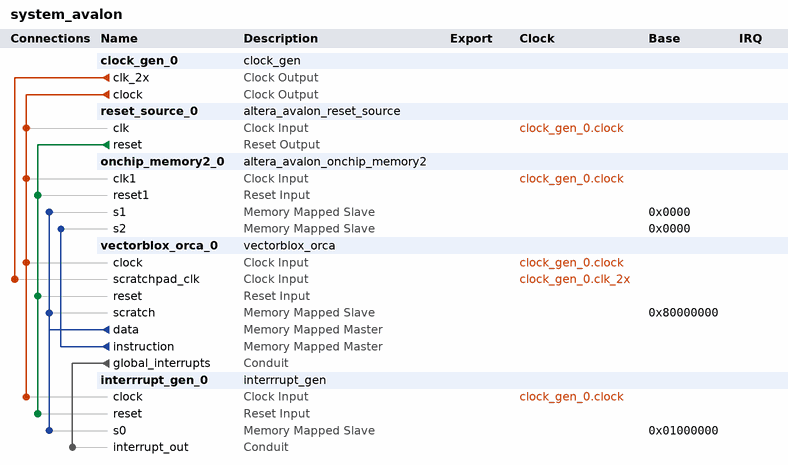
[diagram p0: system contents]
# Platform Designer (Qsys) system system_avalon, Cyclone IV E Unknown
# Parameters at their usual value, and those the tool derives, are not listed.
package require -exact qsys 15.1
create_system system_avalon
set_project_property DEVICE_FAMILY {Cyclone IV E}
set_project_property DEVICE Unknown

add_instance clock_gen_0 clock_gen 1.0
set_instance_parameter_value clock_gen_0 CLK_MHZ 1000

add_instance reset_source_0 altera_avalon_reset_source 15.1
set_instance_parameter_value reset_source_0 ASSERT_HIGH_RESET 1
set_instance_parameter_value reset_source_0 INITIAL_RESET_CYCLES 6

add_instance onchip_memory2_0 altera_avalon_onchip_memory2 15.1
set_instance_parameter_value onchip_memory2_0 dataWidth 32
set_instance_parameter_value onchip_memory2_0 dualPort true
set_instance_parameter_value onchip_memory2_0 initMemContent true
set_instance_parameter_value onchip_memory2_0 initializationFileName test.hex
set_instance_parameter_value onchip_memory2_0 memorySize 65536
set_instance_parameter_value onchip_memory2_0 singleClockOperation true
set_instance_parameter_value onchip_memory2_0 useNonDefaultInitFile true

add_instance vectorblox_orca_0 vectorblox_orca 1.0
set_instance_parameter_value vectorblox_orca_0 BRANCH_PREDICTION false
set_instance_parameter_value vectorblox_orca_0 BTB_SIZE 0
set_instance_parameter_value vectorblox_orca_0 BURST_EN 0
set_instance_parameter_value vectorblox_orca_0 BUS_TYPE Avalon
set_instance_parameter_value vectorblox_orca_0 BYTE_SIZE 8
set_instance_parameter_value vectorblox_orca_0 CACHE_ENABLE 0
set_instance_parameter_value vectorblox_orca_0 CACHE_SIZE 64
set_instance_parameter_value vectorblox_orca_0 COUNTER_LENGTH 64
set_instance_parameter_value vectorblox_orca_0 DIVIDE_ENABLE 1
set_instance_parameter_value vectorblox_orca_0 DRAM_WIDTH 32
set_instance_parameter_value vectorblox_orca_0 ENABLE_EXCEPTIONS 1
set_instance_parameter_value vectorblox_orca_0 ENABLE_EXT_INTERRUPTS 1
set_instance_parameter_value vectorblox_orca_0 EXT_INTERRUPTS 1
set_instance_parameter_value vectorblox_orca_0 FAMILY ALTERA
set_instance_parameter_value vectorblox_orca_0 INTERRUPT_VECTOR 512
set_instance_parameter_value vectorblox_orca_0 LINE_SIZE 16
set_instance_parameter_value vectorblox_orca_0 LVE_ENABLE 1
set_instance_parameter_value vectorblox_orca_0 MULTIPLY_ENABLE 1
set_instance_parameter_value vectorblox_orca_0 PIPELINE_STAGES 5
set_instance_parameter_value vectorblox_orca_0 POWER_OPTIMIZED 0
set_instance_parameter_value vectorblox_orca_0 REGISTER_SIZE 32
set_instance_parameter_value vectorblox_orca_0 RESET_VECTOR 0
set_instance_parameter_value vectorblox_orca_0 SCRATCHPAD_SIZE 64
set_instance_parameter_value vectorblox_orca_0 SHIFTER_MAX_CYCLES 32
set_instance_parameter_value vectorblox_orca_0 TCRAM_SIZE 64

add_instance interrrupt_gen_0 interrrupt_gen 1.0

# connections
add_connection clock_gen_0.clk_2x vectorblox_orca_0.scratchpad_clk clock
add_connection clock_gen_0.clock interrrupt_gen_0.clock clock
add_connection clock_gen_0.clock onchip_memory2_0.clk1 clock
add_connection clock_gen_0.clock reset_source_0.clk clock
add_connection clock_gen_0.clock vectorblox_orca_0.clock clock
add_connection reset_source_0.reset interrrupt_gen_0.reset reset
add_connection reset_source_0.reset onchip_memory2_0.reset1 reset
add_connection reset_source_0.reset vectorblox_orca_0.reset reset
add_connection vectorblox_orca_0.data interrrupt_gen_0.s0 avalon
set_connection_parameter_value vectorblox_orca_0.data/interrrupt_gen_0.s0 baseAddress 0x01000000
add_connection vectorblox_orca_0.data onchip_memory2_0.s1 avalon
set_connection_parameter_value vectorblox_orca_0.data/onchip_memory2_0.s1 baseAddress 0x0000
add_connection vectorblox_orca_0.data vectorblox_orca_0.scratch avalon
set_connection_parameter_value vectorblox_orca_0.data/vectorblox_orca_0.scratch baseAddress 0x80000000
add_connection vectorblox_orca_0.instruction onchip_memory2_0.s2 avalon
set_connection_parameter_value vectorblox_orca_0.instruction/onchip_memory2_0.s2 baseAddress 0x0000
add_connection vectorblox_orca_0.global_interrupts interrrupt_gen_0.interrupt_out conduit

set_interconnect_requirement {$system} qsys_mm.clockCrossingAdapter AUTO
set_interconnect_requirement {$system} qsys_mm.insertDefaultSlave FALSE
set_interconnect_requirement {$system} qsys_mm.maxAdditionalLatency 1

save_system system_avalon.qsys
